# Altium schematic sheet Структура.SchDoc
size A4; SheetNumber: 1; SheetTotal: 3
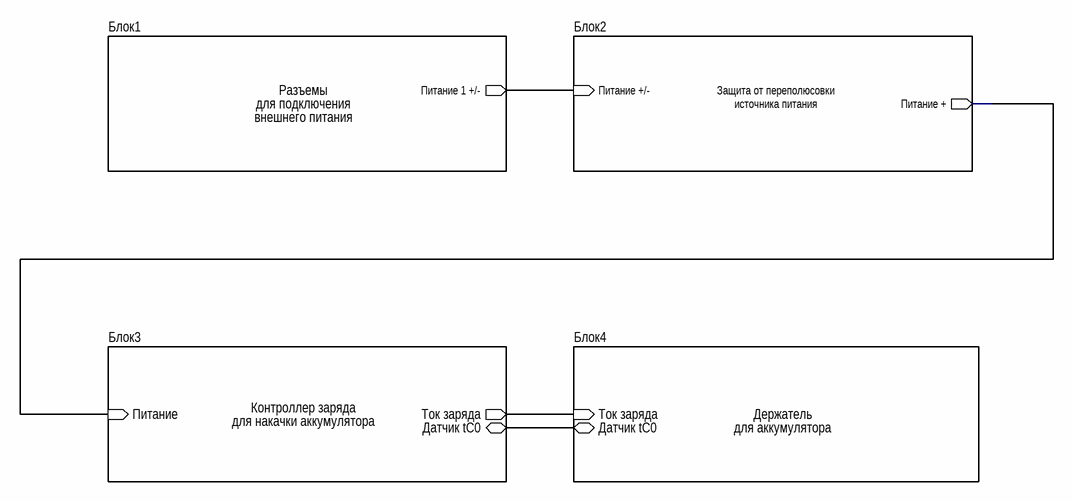
[diagram p0: Структура.SchDoc]

## Sub-sheets
Блок1 = Блок1.SchDoc: Питание 1 +/- (out)  | Parameter 1: Разъемы; Parameter 2: для подключения; Parameter 3: внешнего питания
Блок2 = Блок2.SchDoc: Питание + (out), Питание +/- (in)  | Parameter 1: источника питания; Parameter 3: Защита от переполюсовки
Блок3 = Блок3.SchDoc: Питание (in), Ток заряда (out), Датчик tC0 (bidir)  | Parameter 1: Контроллер заряда; Parameter 2: для накачки аккумулятора; Parameter 3: для накачки аккумулятора
Блок4 = Блок4.SchDoc: Ток заряда (in), Датчик tC0 (bidir)  | Parameter 1: Держатель; Parameter 2: для аккумулятора; Parameter 3: -

## Nets
(unnamed): sheet Блок1/Питание 1 +/-, sheet Блок2/Питание +/-
(unnamed): sheet Блок3/Питание, sheet Блок2/Питание +
(unnamed): sheet Блок3/Ток заряда, sheet Блок4/Ток заряда
(unnamed): sheet Блок3/Датчик tC0, sheet Блок4/Датчик tC0